# Altium schematic sheet CNEPuckCPURevG.SchDoc: Cable Node Expansion Puck
size C; Author: JDV; CompanyName: OPIsystems Inc; DrawnBy: JDV; Engineer: JDV; Organization: OPIsystems Inc; DocumentNumber: CNE; Revision: Rev G; SheetNumber: 1; SheetTotal: 3; PageSetup: Record=PageOptions|CenterHorizontal=True|CenterVertical=True|PrintScale=0.70|XCorrection=1.00|YCorrection=1.00|PrintKind=1|BorderSize=5000000|LeftOffset=0|BottomOffset=0|Orientation=2|PaperLength=4318|PaperWidth=2794|Scale=100|PaperSource=7|PrintQuality=600|MediaType=1|DitherType=10|PaperKind=11x17|PrintScaleMode=1; ProjectName: Swage
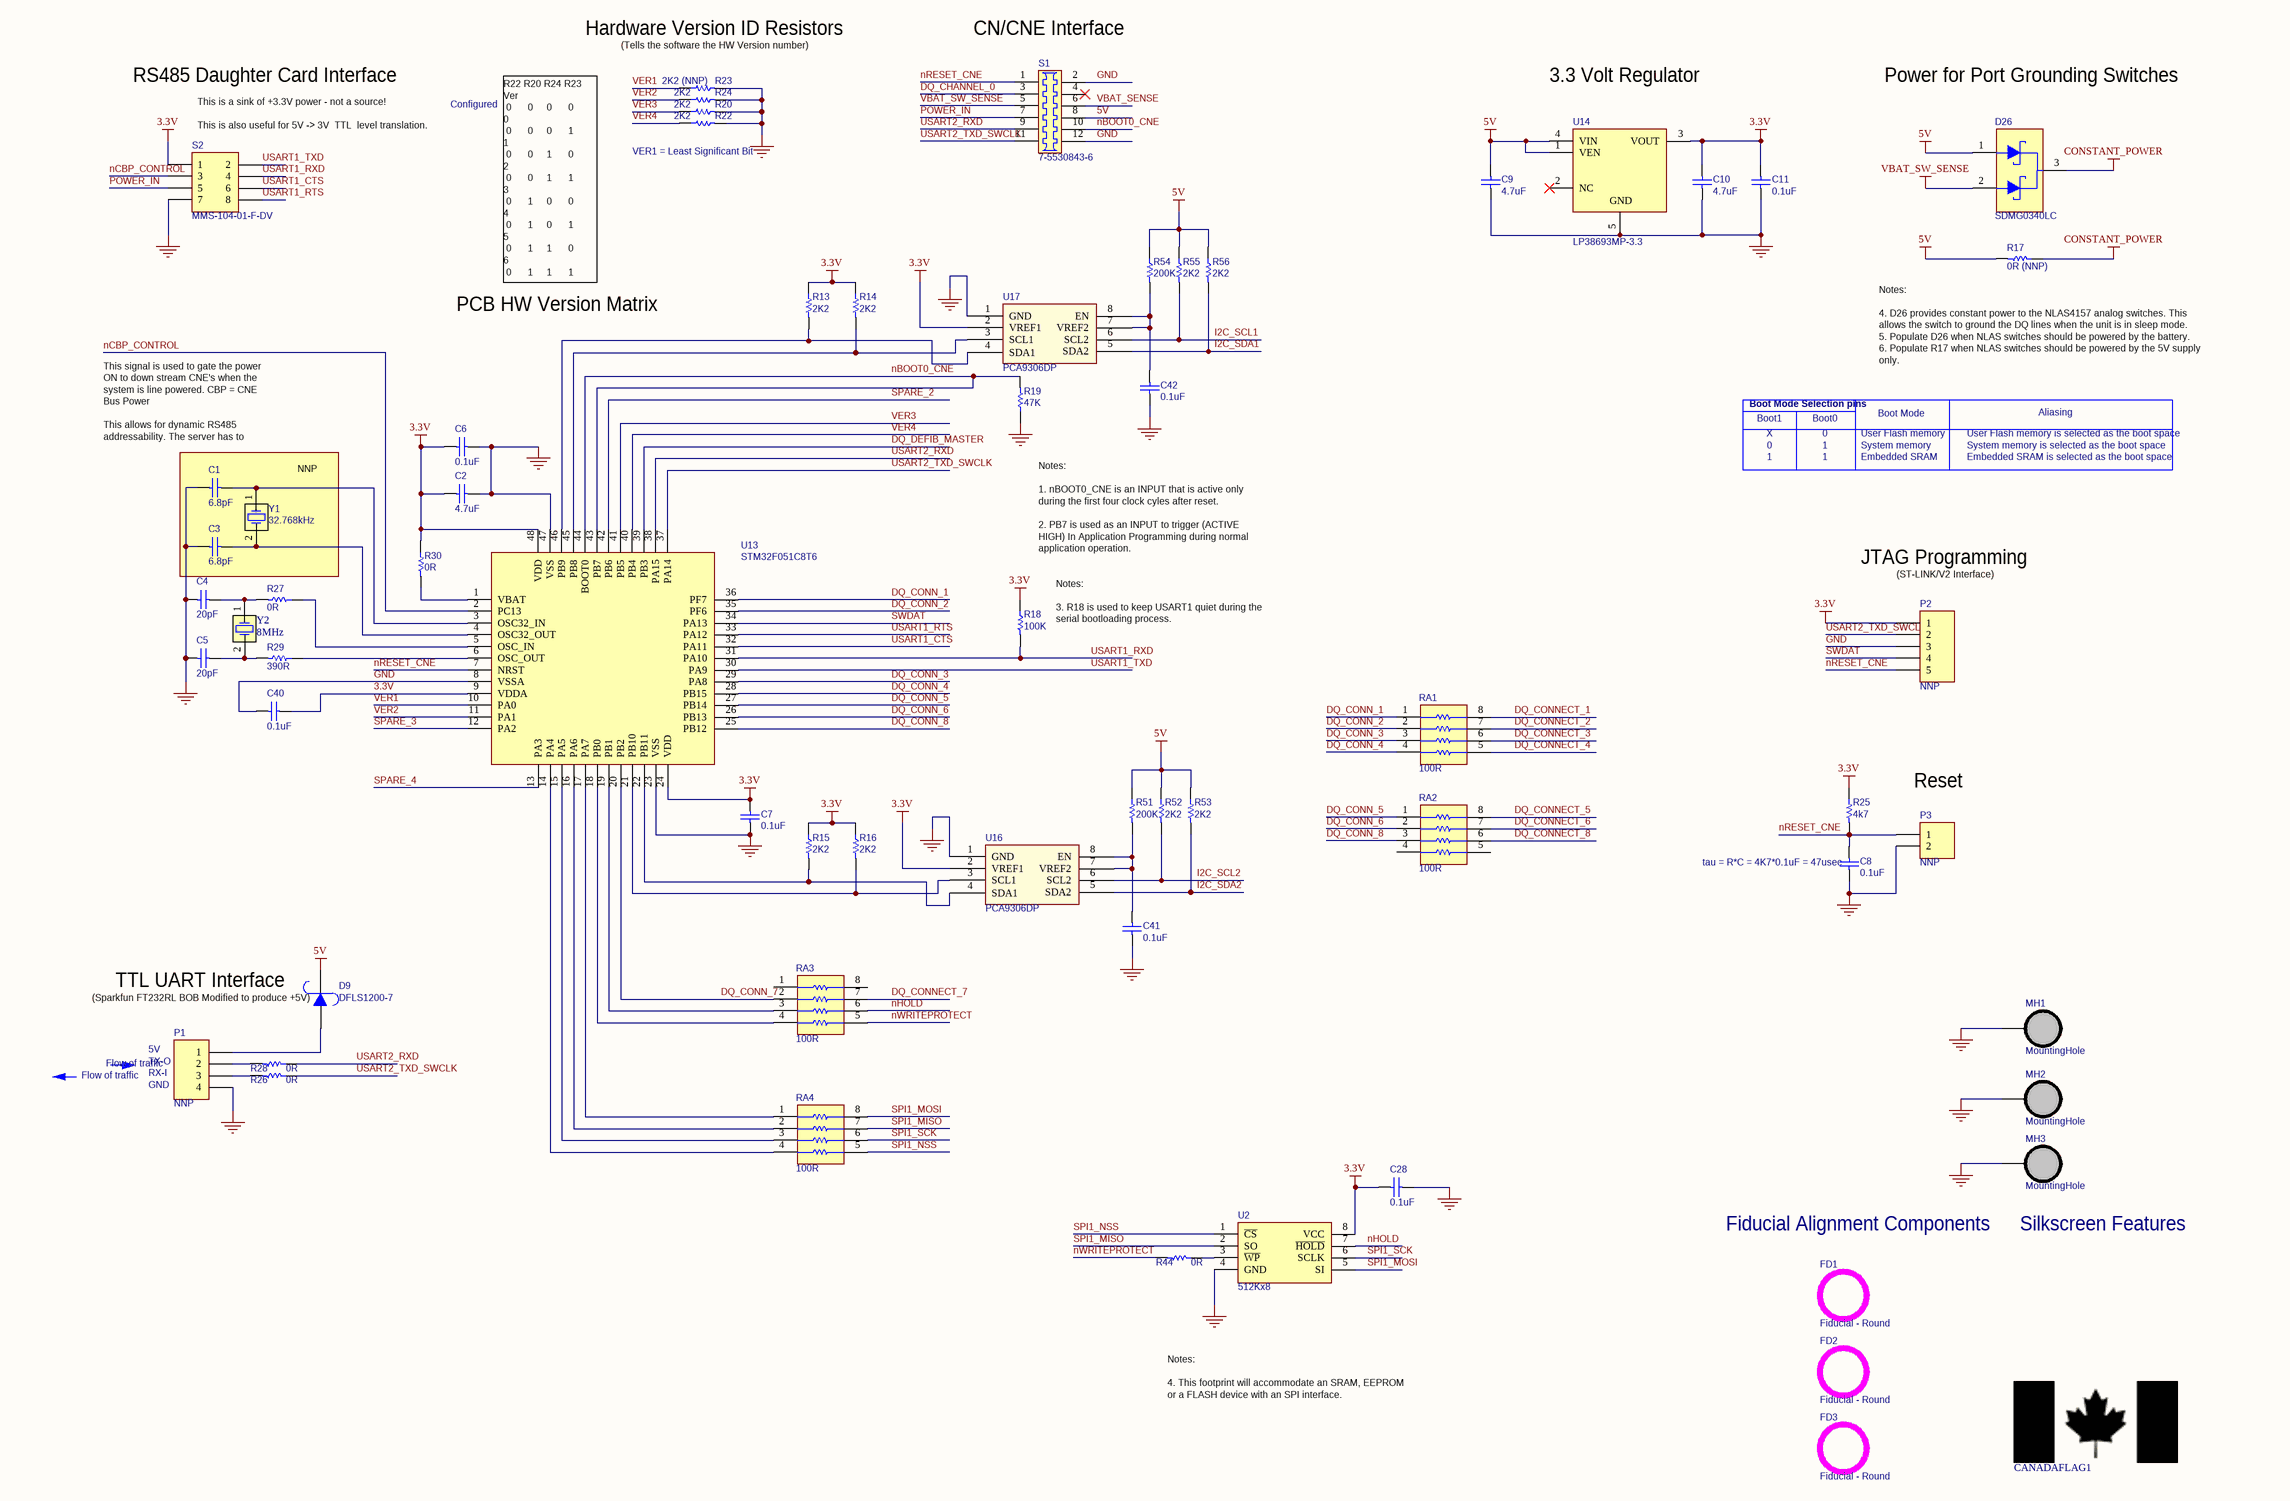
[diagram p0: CNEPuckCPURevG.SchDoc]

## Parts
C1  6.8pF  [RC0603]
C2  4.7uF  [RC0603]
C3  6.8pF  [RC0603]
C4  20pF  [RC0603]
C5  20pF  [RC0603]
C6  0.1uF  [RC0603]
C7  0.1uF  [RC0603]
C8  0.1uF  [RC0603]
C9  4.7uF  [RC0603]
C10  4.7uF  [RC0603]
C11  0.1uF  [RC0603]
C28  0.1uF  [RC0603]
C40  0.1uF  [RC0603]
C41  0.1uF  [RC0603]
C42  0.1uF  [RC0603]
CANADAFLAG1  Canada Flag  [CanadaFlag500x250]  (value not drawn)
D9  DFLS1200-7  [POWERDI-123]
D26  SDMG0340LC  [SOT-323]
FD1  Fiducial - Round  [FIDUCIAL ROUND SMALL]
FD2  Fiducial - Round  [FIDUCIAL ROUND SMALL]
FD3  Fiducial - Round  [FIDUCIAL ROUND SMALL]
MH1  MountingHole  [MountingHole]
MH2  MountingHole  [MountingHole]
MH3  MountingHole  [MountingHole]
P1  NNP  [HDR1X4]
P2  NNP  [HDR1X5]
P3  NNP  [HDR1X2]
R13  2K2  [RC0603]
R14  2K2  [RC0603]
R15  2K2  [RC0603]
R16  2K2  [RC0603]
R17  0R (NNP)  [RC0603]
R18  100K  [RC0603]
R19  47K  [RC0603]
R20  2K2  [RC0603]
R22  2K2  [RC0603]
R23  2K2 (NNP)  [RC0603]
R24  2K2  [RC0603]
R25  4k7  [RC0603]
R26  0R  [RC0603]
R27  0R  [RC0603]
R28  0R  [RC0603]
R29  390R  [RC0603]
R30  0R  [RC0603]
R44  0R  [RC0603]
R51  200K  [RC0603]
R52  2K2  [RC0603]
R53  2K2  [RC0603]
R54  200K  [RC0603]
R55  2K2  [RC0603]
R56  2K2  [RC0603]
RA1  100R  [exb28v]
RA2  100R  [exb28v]
RA3  100R  [exb28v]
RA4  100R  [exb28v]
S1  7-5530843-6  [EdgeConnector-6-12]
S2  MMS-104-01-F-DV  [hirose-2x4]
U2  512Kx8  [SOIC127P600X265-8N]
U13  STM32F051C8T6  [LQFP48-7x7mm]
U14  LP38693MP-3.3  [SOT223]
U16  PCA9306DP  [TSOP65P640X120-8N]
U17  PCA9306DP  [TSOP65P640X120-8N]
Y1  32.768kHz  [FX135]
Y2  8MHz  [NX8045GB]

## Blocks framed on the sheet
NNP: C1 C3 Y1

## Nets
3.3V: C2.2 C6.1 C7.1 C10.2 C11.2 C28.1 C40.2 P2.1 R13.1 R14.1 R15.1 R16.1 R18.1 R25.1 R30.2 S2.1 U2.8(VCC) U13.9(VDDA) U13.24(VDD) U13.48(VDD) U14.3(VOUT) U16.2(VREF1) U17.2(VREF1)
5V: C9.2 D9.2(K) D26.1(A) R17.1 R51.1 R52.1 R53.1 R54.1 R55.1 R56.1 S1.8(DESIGNATOR=8) U14.1(VEN) U14.4(VIN)
CONSTANT_POWER: D26.3(K) R17.2
GND: C1.2 C2.1 C3.2 C4.1 C5.1 C6.2 C7.2 C8.1 C9.1 C10.1 C11.1 C28.2 C40.1 C41.2 C42.2 MH1.1 MH2.1 MH3.1 P1.4 P2.3 P3.2 R19.1 R20.2 R22.2 R23.2 R24.2 S1.2(DESIGNATOR=2) S1.12(DESIGNATOR=12) S2.7 U2.4(GND) U13.8(VSSA) U13.23(VSS) U13.47(VSS) U14.5(GND) U16.1(GND) U17.1(GND)
VBAT_SW_SENSE: D26.2(A) S1.5(DESIGNATOR=5)
DQ_CHANNEL_0: S1.3(DESIGNATOR=3)
DQ_CONN_1: RA1.1 U13.36(PF7)
DQ_CONN_2: RA1.2 U13.35(PF6)
DQ_CONN_3: RA1.3 U13.29(PA8)
DQ_CONN_4: RA1.4 U13.28(PB15)
DQ_CONN_5: RA2.1 U13.27(PB14)
DQ_CONN_6: RA2.2 U13.26(PB13)
DQ_CONN_7: RA3.2 U13.20(PB2)
DQ_CONN_8: RA2.3 U13.25(PB12)
DQ_CONNECT_1: RA1.8
DQ_CONNECT_2: RA1.7
DQ_CONNECT_3: RA1.6
DQ_CONNECT_4: RA1.5
DQ_CONNECT_5: RA2.8
DQ_CONNECT_6: RA2.7
DQ_CONNECT_7: RA3.7
DQ_CONNECT_8: RA2.6
DQ_DEFIB_MASTER: U13.39(PB3)
I2C_SCL1: R55.2 U17.6(SCL2)
I2C_SCL2: R52.2 U16.6(SCL2)
I2C_SDA1: R56.2 U17.5(SDA2)
I2C_SDA2: R53.2 U16.5(SDA2)
nBOOT0_CNE: R19.2 S1.10(DESIGNATOR=10) U13.43(PB7) U13.44(BOOT0)
nCBP_CONTROL: S2.3 U13.2(PC13)
nHOLD: RA3.6 U2.7(~{HOLD})
nRESET_CNE: C8.2 P2.5 P3.1 R25.2 S1.1(DESIGNATOR=1) U13.7(NRST)
nWRITEPROTECT: R44.1 RA3.5
POWER_IN: S1.7(DESIGNATOR=7) S2.5
SPARE_2: U13.42(PB6)
SPARE_3: U13.12(PA2)
SPARE_4: U13.13(PA3)
SPI1_MISO: RA4.7 U2.2(SO)
SPI1_MOSI: RA4.8 U2.5(SI)
SPI1_NSS: RA4.5 U2.1(~{CS})
SPI1_SCK: RA4.6 U2.6(SCLK)
SWDAT: P2.4 U13.34(PA13)
USART1_CTS: S2.6 U13.32(PA11)
USART1_RTS: S2.8 U13.33(PA12)
USART1_RXD: R18.2 S2.4 U13.31(PA10)
USART1_TXD: S2.2 U13.30(PA9)
USART2_RXD: R28.2 S1.9(DESIGNATOR=9) U13.38(PA15)
USART2_TXD_SWCLK: P2.2 R26.2 S1.11(DESIGNATOR=11) U13.37(PA14)
VBAT_SENSE: S1.6(DESIGNATOR=6)
VER1: R23.1 U13.10(PA0)
VER2: R24.1 U13.11(PA1)
VER3: R20.1 U13.41(PB5)
VER4: R22.1 U13.40(PB4)
NetC1_1: C1.1 U13.3(OSC32_IN) Y1.1(OSC1)
NetC3_1: C3.1 U13.4(OSC32_OUT) Y1.2(OSC2)
NetC4_2: C4.2 R27.1 Y2.1(OSC1)
NetC5_2: C5.2 R29.2 Y2.2(OSC2)
NetC41_1: C41.1 R51.2 U16.7(VREF2) U16.8(EN)
NetC42_1: C42.1 R54.2 U17.7(VREF2) U17.8(EN)
NetD9_1: D9.1(A) P1.1
NetP1_2: P1.2 R28.1
NetP1_3: P1.3 R26.1
NetR13_2: R13.2 U13.46(PB9) U17.4(SDA1)
NetR14_2: R14.2 U13.45(PB8) U17.3(SCL1)
NetR15_2: R15.2 U13.22(PB11) U16.4(SDA1)
NetR16_2: R16.2 U13.21(PB10) U16.3(SCL1)
NetR27_2: R27.2 U13.5(OSC_IN)
NetR29_1: R29.1 U13.6(OSC_OUT)
NetR30_1: R30.1 U13.1(VBAT)
NetR44_2: R44.2 U2.3(~{WP})
NetRA3_3: RA3.3 U13.19(PB1)
NetRA3_4: RA3.4 U13.18(PB0)
NetRA4_1: RA4.1 U13.17(PA7)
NetRA4_2: RA4.2 U13.16(PA6)
NetRA4_3: RA4.3 U13.15(PA5)
NetRA4_4: RA4.4 U13.14(PA4)

Not connected (* = marked no-connect by the designer): RA2 4 5; RA3 1 8; S1 4(DESIGNATOR=4)*; U14 2(NC)*

## Notes on the sheet
- Hardware Version ID Resistors
- (Tells the software the HW Version number)
- (near S1) CN/CNE Interface
- RS485 Daughter Card Interface
- (near S2) This is a sink of +3.3V power - not a source!
  This is also useful for 5V -> 3V  TTL  level translation.
- Configured
- 3.3 Volt Regulator
- Power for Port Grounding Switches
- VER1 = Least Significant Bit
- PCB HW Version Matrix
- R22 R20 R24 R23  Ver
  0      0     0      0       0
  0      0     0      1       1
  0      0     1      0       2
  0      0     1      1       3
  0      1     0      0       4
  0      1     0      1       5
  0      1     1      0       6
  0      1     1      1       7
  1      0     0      0       8
  1      0     0      1       9
  1      0     1      0       10
  1      0     1      1       11
  1      1     0      0       12
  1      1     0      1       13
  1      1     1      0       14
  1      1     1      1       15
- (near R17) Notes:
  4. D26 provides constant power to the NLAS4157 analog switches. This allows the switch to ground the DQ lines when the unit is in sleep mode.
  5. Populate D26 when NLAS switches should be powered by the battery.
  6. Populate R17 when NLAS switches should be powered by the 5V supply only.
- Boot Mode Selection pins
- Boot1
- Boot0
- Boot Mode
- Aliasing
- This signal is used to gate the power ON to down stream CNE's when the system is line powered. CBP = CNE Bus Power
  This allows for dynamic RS485 addressability. The server has to discover and assign an address to this unit.
- X
- 1
- 0
- User Flash memory
- System memory
- Embedded SRAM
- User Flash memory is selected as the boot space
- System memory is selected as the boot space
- Embedded SRAM is selected as the boot space
- Notes:
  1. nBOOT0_CNE is an INPUT that is active only during the first four clock cyles after reset.
  2. PB7 is used as an INPUT to trigger (ACTIVE HIGH) In Application Programming during normal application operation.
- JTAG Programming
- (near P2) (ST-LINK/V2 Interface)
- (near R18) Notes:
  3. R18 is used to keep USART1 quiet during the serial bootloading process.
- Reset
- (near C8) tau = R*C = 4K7*0.1uF = 47usec
- (near D9) (Sparkfun FT232RL BOB Modified to produce +5V)
- (near D9) TTL UART Interface
- Flow of traffic
- 5V
- (near P1) TX-O
- (near P1) RX-I
- (near P1) GND
- Fiducial Alignment Components
- Silkscreen Features
- Notes:
  4. This footprint will accommodate an SRAM, EEPROM or a FLASH device with an SPI interface.
- Title:
- OPIsystems Inc.
- Size:
- Date:
- File:
- C
- Number:
- Time:
- Revision:
- Sheet
- of
- Calgary, AB, Canada
- T2E 6M8
- 403-219-3177
- www.opisystems.com
- 1216 - 36th Avenue NE

## Library data of the parts
C1 C3 = C1608C0G1H6R8D: CAP CER 6.8PF 50V NP0 0603; Manufacturer: TDK Corporation; Tolerance: ±0.5pF; Temperature Coefficient: C0G, NP0; OPI_VID: 101353; Supplier 1: Digi-Key; Manufacturer Part Number: C1608C0G1H6R8D; RoHS: RoHS Compliant; Category: Capacitors; Stock 1: 72000; Pricing 1: 4000=0.00863, 8000=0.00788, 12000=0.00751, 28000=0.00713, 100000=0.00516 (CAD); Capacitance: 6.8pF; Voltage - Rated: 50V; Mounting Type: Surface Mount, MLCC; Operating Temperature: -55°C ~ 125°C; Applications: General Purpose; Ratings: -; Package / Case: 0603 (1608 Metric); Size / Dimension: 0.063" L x 0.031" W (1.60mm x 0.80mm); Height - Seated (Max): -; Thickness (Max): 0.037" (0.95mm); Lead Spacing: -; Features: -; Packaging: Tape & Reel (TR); Lead Style: -; ComponentLink1URL: http://www.tdk.com/pdf/general_B11.pdf; ComponentLink1Description: http://www.tdk.com/pdf/general_B11.pdf; Supplier Part Number 1: 445-5039-2-ND
C2 C9 C10 = C1608X5R1A475K/0.50: CAP CER 4.7UF 10V 10% X5R 0603; Manufacturer: TDK Corporation; Capacitance: 4.7µF; OPI_VID: 101354; Supplier 1: Digi-Key; Manufacturer Part Number: C1608X5R1A475K/0.50; RoHS: RoHS Compliant; Category: Capacitors; Stock 1: 44000; Pricing 1: 4000=0.04904, 8000=0.04639, 12000=0.044, 28000=0.04241, 100000=0.03512 (CAD); Voltage - Rated: 10V; Tolerance: ±10%; Temperature Coefficient: X5R; Mounting Type: Surface Mount, MLCC; Operating Temperature: -55°C ~ 85°C; Applications: General Purpose; Ratings: -; Package / Case: 0603 (1608 Metric); Size / Dimension: 0.063" L x 0.031" W (1.60mm x 0.80mm); Height - Seated (Max): -; Thickness (Max): 0.022" (0.55mm); Lead Spacing: -; Features: -; Packaging: Tape & Reel (TR); Lead Style: -; ComponentLink1URL: http://www.tdk.com/pdf/general_B11.pdf; ComponentLink1Description: http://www.tdk.com/pdf/general_B11.pdf; Supplier Part Number 1: 445-7482-2-ND
C4 C5 = CC0603JRNPO9BN200: CAP CER 20PF 50V 5% NPO 0603; Manufacturer: Yageo; Temperature Coefficient: C0G, NP0; OPI_VID: 101355; Supplier 1: Digi-Key; Manufacturer Part Number: CC0603JRNPO9BN200; RoHS: RoHS Compliant; Category: Capacitors; Stock 1: 4000; Pricing 1: 4000=0.00619, 8000=0.00565, 12000=0.00538, 28000=0.00511, 100000=0.0037 (CAD); Capacitance: 20pF; Voltage - Rated: 50V; Tolerance: ±5%; Mounting Type: Surface Mount, MLCC; Operating Temperature: -55°C ~ 125°C; Applications: General Purpose; Ratings: -; Package / Case: 0603 (1608 Metric); Size / Dimension: 0.063" L x 0.031" W (1.60mm x 0.80mm); Height - Seated (Max): -; Thickness (Max): 0.035" (0.90mm); Lead Spacing: -; Features: -; Packaging: Tape & Reel (TR); Lead Style: -; ComponentLink1URL: http://www.yageo.com/documents/recent/UPY-GP_NP0_16V-to-50V_8.pdf; ComponentLink1Description: http://www.yageo.com/documents/recent/UPY-GP_NP0_16V-to-50V_8.pdf; Supplier Part Number 1: 311-1424-2-ND
C6-C8 C11 C28 C40-C42 = 0603YC104KAT2A: CAP CERM .1UF 10% 16V X7R 0603; Manufacturer: AVX Corporation; Category 1: Capacitors; Capacitance: 0.1µF; OPI_VID: 100039; Supplier 1: Digi-Key; Supplier Part Number 1: 478-1239-2-ND; RoHS 1: RoHS Compliant; Description 1: CAP CERM .1UF 10% 16V X7R 0603; Stock 1: 5240000; Pricing 1: 4000=0.003, 12000=0.002, 24000=0.002 (USD); Voltage - Rated: 16V; Tolerance: ±10%; Temperature Coefficient: X7R; Mounting Type: Surface Mount, MLCC; Operating Temperature: -55°C ~ 125°C; Features: -; Applications: General Purpose; Ratings: -; Package / Case: 0603 (1608 Metric); Size / Dimension: 0.063" L x 0.031" W (1.60mm x 0.80mm); Thickness: 0.90mm Max; Lead Spacing: -; Packaging: Tape & Reel (TR); Lead Style: -; ComponentLink1URL: http://www.avx.com/docs/Catalogs/cx7r.pdf; ComponentLink1Description: http://www.avx.com/docs/Catalogs/cx7r.pdf; Manufacturer Part Number: 0603YC104KAT2A
CANADAFLAG1 = CanadaFlag
D9 = DFLS1200-7: DIODE SCHOTTKY 1A 200V PWRDI 123; Manufacturer: Diodes Inc; Voltage - Forward (Vf) (Max) @ If: 850mV @ 1A; Speed: Fast Recovery =< 500ns, > 200mA (Io); Current - Reverse Leakage @ Vr: 2µA @ 200V; Capacitance @ Vr, F: 23pF @ 5V, 1MHz; OPI_VID: 101018; Supplier 1: Digi-Key; Supplier Part Number 1: DFLS1200DITR-ND; Manufacturer Part Number: DFLS1200-7; RoHS: RoHS Compliant; Category: Discrete Semiconductor Products; Stock 1: 21000; Pricing 1: 3000=0.22411, 6000=0.21017, 12000=0.19516, 27000=0.18444, 51000=0.18122 (CAD); Diode Type: Schottky; Voltage - DC Reverse (Vr) (Max): 200V; Current - Average Rectified (Io): 1A; Reverse Recovery Time (trr): -; Mounting Type: Surface Mount; Package / Case: 2-SMD, Flat Lead; Supplier Device Package: PowerDI™ 123; Packaging: Tape & Reel (TR); ComponentLink1URL: http://www.diodes.com/datasheets/ds30628.pdf; ComponentLink1Description: http://www.diodes.com/datasheets/ds30628.pdf
D26 = SDMG0340LC-7-F: DIODE SCHOTTKY 40V 30MA SOT323; Manufacturer: Diodes Inc; Voltage - Forward (Vf) (Max) @ If: 370mV @ 1mA; Current - Reverse Leakage @ Vr: 1µA @ 10V; Current - Average Rectified (Io) (per Diode): 30mA (DC); Speed: Small Signal =< 200mA (Io), Any Speed; Diode Configuration: 1 Pair Common Cathode; OPI_VID: 101482; Supplier 1: Digi-Key; Supplier Part Number 1: SDMG0340LC-FDITR-ND; Manufacturer Part Number: SDMG0340LC-7-F; RoHS: RoHS Compliant; Category: Discrete Semiconductor Products; Stock 1: 18000; Pricing 1: 3000=0.08059, 6000=0.07254, 15000=0.06447, 30000=0.06045, 75000=0.05359, 150000=0.05037 (CAD); Packaging: Tape & Reel (TR); Voltage - DC Reverse (Vr) (Max): 40V; Reverse Recovery Time (trr): -; Diode Type: Schottky; Mounting Type: Surface Mount; Package / Case: SC-70, SOT-323; Supplier Device Package: SOT-323; ComponentLink1URL: http://www.diodes.com/datasheets/ds30248.pdf; ComponentLink1Description: http://www.diodes.com/datasheets/ds30248.pdf
FD1-FD3 = Fiducial: Fiducial Round
MH1-MH3 = MountingHole: PCB Mounting Hole, 0.150" hole, 0.270" Keepout
P1 = Header 4: Header, 4-Pin; Manufacturer: 3M; Manufacturer Part Number: 2340-6111TG; OPI_VID: 100210; Comment_1: Cut to 4 Position; LatestRevisionDate: 17-Jul-2002; LatestRevisionNote: Re-released for DXP Platform.; Publisher: Altium Limited
P2 = Header 5: Header, 5-Pin; Manufacturer Part Number: 2340-6111TG; Manufacturer: 3M; OPI_VID: 100210; Comment_1: Cut to 5 Position; LatestRevisionDate: 17-Jul-2002; LatestRevisionNote: Re-released for DXP Platform.; Publisher: Altium Limited
P3 = Header 2: Header, 2-Pin; Manufacturer: 3M; Manufacturer Part Number: 2340-6111TG; OPI_VID: 100210; LatestRevisionDate: 17-Jul-2002; LatestRevisionNote: Re-released for DXP Platform.; Publisher: Altium Limited
R13-R16 R20 R22-R24 R52 R53 R55 R56 = ERJ-3GEYJ222V: RES 2.2K OHM 1/10W 5% 0603 SMD; Manufacturer: Panasonic Electronic Components; Power (Watts): 0.1W, 1/10W; Temperature Coefficient: ±200ppm/°C; OPI_VID: 101388; Supplier 1: Digi-Key; Supplier Part Number 1: P2.2KGTR-ND; Manufacturer Part Number: ERJ-3GEYJ222V; RoHS: RoHS Compliant; Category: Resistors; Stock 1: 970000; Pricing 1: 5000=0.00176, 10000=0.00153, 25000=0.00134, 50000=0.00123, 125000=0.00121 (CAD); Resistance (Ohms): 2.2k; Composition: Thick Film; Features: -; Tolerance: ±5%; Package / Case: 0603 (1608 Metric); Size / Dimension: 0.063" L x 0.031" W (1.60mm x 0.80mm); Height: 0.022" (0.55mm); Number of Terminations: 2; Packaging: Tape & Reel (TR); ComponentLink1URL: http://industrial.panasonic.com/www-cgi/jvcr13pz.cgi?E+PZ+3+AOA0001+ERJ3GEYJ222V+7+WW; ComponentLink1Description: http://industrial.panasonic.com/www-cgi/jvcr13pz.cgi?E+PZ+3+AOA0001+ERJ3GEYJ222V+7+WW; Supplier Device Package: 0603
R17 R26-R28 R30 R44 = ERJ-3GEY0R00V: RES 0.0 OHM 1/10W 0603 SMD; Manufacturer: Panasonic - ECG; Category 1: Resistors; Resistance (Ohms): 0.0; Power (Watts): 0.1W, 1/10W; Temperature Coefficient: -100/ +600ppm/°C; Tolerance: Jumper; OPI_VID: 101042; Supplier 1: Digi-Key; Supplier Part Number 1: P0.0GTR-ND; RoHS 1: RoHS Compliant; Description 1: RES 0.0 OHM 1/10W 0603 SMD; Stock 1: 25505000; Pricing 1: 5000=0.00171, 10000=0.00149, 25000=0.00131 (USD); Composition: Thick Film; Features: -; Size / Dimension: 0.063" L x 0.031" W (1.60mm x 0.80mm); Height: 0.018" (0.45mm); Lead Style: Surface Mount (SMD - SMT); Packaging: Tape & Reel (TR); Package / Case: 0603 (1608 Metric); ComponentLink1URL: http://industrial.panasonic.com/www-cgi/jvcr13pz.cgi?E+PZ+3+AOA0001+ERJ3GEY0R00V+7+WW; ComponentLink1Description: http://industrial.panasonic.com/www-cgi/jvcr13pz.cgi?E+PZ+3+AOA0001+ERJ3GEY0R00V+7+WW; Manufacturer Part Number: ERJ-3GEY0R00V
R18 = ERJ-3GEYJ104V: RES 100K OHM 1/10W 5% 0603 SMD; Manufacturer: Panasonic Electronic Components; Power (Watts): 0.1W, 1/10W; Temperature Coefficient: ±200ppm/°C; OPI_VID: 101335; Supplier 1: Digi-Key; Manufacturer Part Number: ERJ-3GEYJ104V; RoHS: RoHS Compliant; Category: Resistors; Stock 1: 3755000; Pricing 1: 5000=0.00172, 10000=0.00149, 25000=0.00131, 50000=0.0012, 125000=0.00118 (CAD); Resistance (Ohms): 100k; Composition: Thick Film; Features: -; Tolerance: ±5%; Package / Case: 0603 (1608 Metric); Size / Dimension: 0.063" L x 0.031" W (1.60mm x 0.80mm); Height: 0.022" (0.55mm); Number of Terminations: 2; Packaging: Tape & Reel (TR); ComponentLink1URL: http://industrial.panasonic.com/www-cgi/jvcr13pz.cgi?E+PZ+3+AOA0001+ERJ3GEYJ104V+7+WW; ComponentLink1Description: http://industrial.panasonic.com/www-cgi/jvcr13pz.cgi?E+PZ+3+AOA0001+ERJ3GEYJ104V+7+WW; Supplier Part Number 1: P100KGTR-ND
R19 = ERJ-3GEYJ473V: RES 47K OHM 1/10W 5% 0603 SMD; Manufacturer: Panasonic - ECG; Category 1: Resistors; Power (Watts): 0.1W, 1/10W; Temperature Coefficient: ±200ppm/°C; OPI_VID: 101043; Supplier 1: Digi-Key; Supplier Part Number 1: P47KGTR-ND; RoHS 1: RoHS Compliant; Description 1: RES 47K OHM 1/10W 5% 0603 SMD; Stock 1: 2125000; Pricing 1: 5000=0.00171, 10000=0.00149, 25000=0.00131 (USD); Resistance (Ohms): 47K; Composition: Thick Film; Features: -; Tolerance: ±5%; Size / Dimension: 0.063" L x 0.031" W (1.60mm x 0.80mm); Height: 0.018" (0.45mm); Lead Style: Surface Mount (SMD - SMT); Packaging: Tape & Reel (TR); Package / Case: 0603 (1608 Metric); ComponentLink1URL: http://industrial.panasonic.com/www-cgi/jvcr13pz.cgi?E+PZ+3+AOA0001+ERJ3GEYJ473V+7+WW; ComponentLink1Description: http://industrial.panasonic.com/www-cgi/jvcr13pz.cgi?E+PZ+3+AOA0001+ERJ3GEYJ473V+7+WW; Manufacturer Part Number: ERJ-3GEYJ473V
R25 = ERJ-3GEYJ472V: RES 4.7K OHM 1/10W 5% 0603 SMD; Manufacturer: Panasonic - ECG; Power (Watts): 0.1W, 1/10W; Temperature Coefficient: ±200ppm/°C; OPI_VID: 101175; Supplier 1: Digi-Key; Supplier Part Number 1: P4.7KGTR-ND; Manufacturer Part Number: ERJ-3GEYJ472V; RoHS: RoHS Compliant; Category: Resistors; Stock 1: 6230000; Pricing 1: 5000=0.00174, 10000=0.00151, 25000=0.00132 (CAD); Resistance (Ohms): 4.7K; Composition: Thick Film; Features: -; Tolerance: ±5%; Size / Dimension: 0.063" L x 0.031" W (1.60mm x 0.80mm); Height: 0.022" (0.55mm); Number of Terminations: 2; Packaging: Tape & Reel (TR); Package / Case: 0603 (1608 Metric); ComponentLink1URL: http://industrial.panasonic.com/www-cgi/jvcr13pz.cgi?E+PZ+3+AOA0001+ERJ3GEYJ472V+7+WW; ComponentLink1Description: http://industrial.panasonic.com/www-cgi/jvcr13pz.cgi?E+PZ+3+AOA0001+ERJ3GEYJ472V+7+WW
R29 = ERJ-3GEYJ391V: RES 390 OHM 1/10W 5% 0603 SMD; Manufacturer: Panasonic Electronic Components; Resistance (Ohms): 390; Power (Watts): 0.1W, 1/10W; Temperature Coefficient: ±200ppm/°C; OPI_VID: 101357; Supplier 1: Digi-Key; Manufacturer Part Number: ERJ-3GEYJ391V; RoHS: RoHS Compliant; Category: Resistors; Stock 1: 1115000; Pricing 1: 5000=0.00174, 10000=0.00151, 25000=0.00132, 50000=0.00122, 125000=0.00119 (CAD); Composition: Thick Film; Features: -; Tolerance: ±5%; Package / Case: 0603 (1608 Metric); Size / Dimension: 0.063" L x 0.031" W (1.60mm x 0.80mm); Height: 0.022" (0.55mm); Number of Terminations: 2; Packaging: Tape & Reel (TR); ComponentLink1URL: http://industrial.panasonic.com/www-cgi/jvcr13pz.cgi?E+PZ+3+AOA0001+ERJ3GEYJ391V+7+WW; ComponentLink1Description: http://industrial.panasonic.com/www-cgi/jvcr13pz.cgi?E+PZ+3+AOA0001+ERJ3GEYJ391V+7+WW; Supplier Part Number 1: P390GTR-ND
R51 R54 = ERJ-3GEYJ204V: RES 200K OHM 1/10W 5% 0603 SMD; Manufacturer: Panasonic Electronic Components; Resistance (Ohms): 100k; Power (Watts): 0.1W, 1/10W; Temperature Coefficient: ±200ppm/°C; OPI_VID: 101538; Supplier 1: Digi-Key; Supplier Part Number 1: P100KGTR-ND; Manufacturer Part Number: ERJ-3GEYJ204V; RoHS: RoHS Compliant; Category: Resistors; Stock 1: 3755000; Pricing 1: 5000=0.00172, 10000=0.00149, 25000=0.00131, 50000=0.0012, 125000=0.00118 (CAD); Composition: Thick Film; Features: -; Tolerance: ±5%; Package / Case: 0603 (1608 Metric); Size / Dimension: 0.063" L x 0.031" W (1.60mm x 0.80mm); Height: 0.022" (0.55mm); Number of Terminations: 2; Packaging: Tape & Reel (TR); ComponentLink1URL: http://industrial.panasonic.com/www-cgi/jvcr13pz.cgi?E+PZ+3+AOA0001+ERJ3GEYJ104V+7+WW; ComponentLink1Description: http://industrial.panasonic.com/www-cgi/jvcr13pz.cgi?E+PZ+3+AOA0001+ERJ3GEYJ104V+7+WW
RA1-RA4 = EXB-28V101JX: RES ARRAY 100 OHM 4 RES 0804; Manufacturer: Panasonic Electronic Components; Circuit Type: Isolated; Resistance (Ohms): 100; Number of Resistors: 4; Power Per Element: 31mW; Tolerance: ±5%; Temperature Coefficient: ±200ppm/°C; OPI_VID: 101389; Supplier 1: Digi-Key; Supplier Part Number 1: Y7101TR-ND; Manufacturer Part Number: EXB-28V101JX; RoHS: RoHS Compliant; Category: Resistors; Stock 1: 200000; Pricing 1: 10000=0.01298, 30000=0.01141, 50000=0.01047, 100000=0.01025 (CAD); Number of Pins: 8; Applications: -; Mounting Type: Surface Mount; Package / Case: 0804 (2010 Metric), Convex; Supplier Device Package: 0402 x 4; Size / Dimension: 0.079" L x 0.039" W (2.00mm x 1.00mm); Height: 0.014" (0.35mm); Packaging: Tape & Reel (TR); Operating Temperature: -55°C ~ 125°C; ComponentLink1URL: http://industrial.panasonic.com/www-cgi/jvcr13pz.cgi?E+PZ+3+AOC0001+EXB28V101JX+7+WW; ComponentLink1Description: http://industrial.panasonic.com/www-cgi/jvcr13pz.cgi?E+PZ+3+AOC0001+EXB28V101JX+7+WW
S1 = 7-5530843-6: CONN EDGECARD 6POS .100 VERT; Manufacturer: TE Connectivity; Card Type: Multibus I; Gender: Female; Number of Positions: 12; Card Thickness: 0.054" ~ 0.070" (1.37mm ~ 1.78mm); Pitch: 0.100" (2.54mm); Material - Insulation: Polyester, Glass Filled; Read Out: Dual; OPI_VID: 101359; Supplier 1: Digi-Key; Manufacturer Part Number: 7-5530843-6; RoHS: RoHS Compliant; Category: Connectors, Interconnects; Stock 1: 2145; Pricing 1: 1=2.55, 10=2.316, 25=2.1748, 50=2.08, 100=1.9855, 250=1.79636, 500=1.65458, 1000=1.41821, 2500=1.32366 (CAD); Number of Positions/Bay/Row: -; Number of Rows: 2; Features: -; Mounting Type: Through Hole; Termination: Solder; Contact Material: Phosphor Bronze; Contact Finish: Gold; Contact Finish Thickness: 30µin (0.76µm); Contact Type: -; Color: Black; Packaging: Bulk; Flange Feature: -; Operating Temperature: -55°C ~ 85°C; ComponentLink1URL: http://www.te.com/commerce/DocumentDelivery/DDEController?Action=srchrtrv&DocNm=5530843&DocType=Customer+Drawing&DocLang=English; ComponentLink1Description: http://www.te.com/commerce/DocumentDelivery/DDEController?Action=srchrtrv&DocNm=5530843&DocType=Customer+Drawing&DocLang=English; Supplier Part Number 1: 7-5530843-6-ND
S2 = MMS-104-01-F-DV: CONN RCPT 2MM 8POS DL VERT PCB; Manufacturer: Samtec Inc; Connector Type: Receptacle; Number of Positions: 8; Number of Positions Loaded: All; Pitch: 0.079" (2.00mm); OPI_VID: 101488; Single Source: YES, 2 week lead time; Supplier 1: Digi-Key; Manufacturer Part Number: MMS-104-01-F-DV; RoHS: RoHS Compliant; Category: Connectors, Interconnects; Stock 1: 0; Pricing 1: 1=2.61, 10=2.261, 100=1.9131, 500=1.52184, 1000=1.23922, 5000=1.13051, 10000=1.08703 (CAD); Contact Type: Female Socket; Number of Rows: 2; Row Spacing: 0.079" (2.00mm); Mounting Type: Through Hole; Termination: Solder; Fastening Type: -; Features: -; Contact Finish: Tin; Contact Finish Thickness: -; Color: Black; Packaging: Tube; ComponentLink1URL: http://www.samtec.com/ftppub/cpdf/MMS01MKT.PDF; ComponentLink1Description: http://www.samtec.com/ftppub/cpdf/MMS01MKT.PDF; Supplier Part Number 1: SAM1232-04-ND
U2 = 23LCV512-I/SN: IC SRAM SPI 512K 2.5V 8SOIC; Manufacturer: Microchip Technology; Format - Memory: RAM; Memory Type: NVSRAM (Non-Volatile SRAM); Memory Size: 512K (64K x 8); Speed: 20MHz; Interface: SPI Serial; Voltage - Supply: 2.5 V ~ 5.5 V; OPI_VID: 101391; Single Source: YES, 13 week lead time; Supplier 1: Digi-Key; Manufacturer Part Number: 23LCV512-I/SN; RoHS: RoHS Compliant; Category: Integrated Circuits (ICs); Stock 1: 300; Pricing 1: 1=2.59, 10=1.847, 25=1.782, 100=1.7061 (CAD); Operating Temperature: -40°C ~ 85°C; Package / Case: 8-SOIC (0.154", 3.90mm Width); Supplier Device Package: 8-SOIC N; Packaging: Tube; Supplier Part Number 1: 23LCV512-I/SN-ND
U13 = STM32F051C8T6: IC MCU 32BIT 64KB FLASH 48LQFP; Manufacturer: STMicroelectronics; Core Processor: ARM® Cortex™-M0; Core Size: 32-Bit; Speed: 48MHz; Connectivity: HDMI-CEC, I²C, IrDA, LIN, SPI, UART/USART; Peripherals: DMA, I²S, POR, PWM, WDT; Number of I /O: 39; Program Memory Size: 64KB (64K x 8); RAM Size: 8K x 8; Voltage - Supply (Vcc/Vdd): 2 V ~ 3.6 V; Data Converters: A/D 10x12b, D/A 1x12b; Oscillator Type: Internal; OPI_VID: 101360; Supplier 1: Digi-Key; Manufacturer Part Number: STM32F051C8T6; RoHS: RoHS Compliant; Category: Integrated Circuits (ICs); Stock 1: 197; Pricing 1: 1=3.74, 10=3.346, 25=3.0112, 100=2.7434, 250=2.47576, 500=2.22148, 1000=1.87354, 2500=1.77986, 5000=1.71295 (CAD); Program Memory Type: FLASH; EEPROM Size: -; Operating Temperature: -40°C ~ 85°C; Package / Case: 48-LQFP; Packaging: Tray; ComponentLink1URL: http://www.st.com/internet/com/TECHNICAL_RESOURCES/TECHNICAL_LITERATURE/DATA_BRIEF/DM00026694.pdf; ComponentLink1Description: http://www.st.com/internet/com/TECHNICAL_RESOURCES/TECHNICAL_LITERATURE/DATA_BRIEF/DM00026694.pdf; Supplier Part Number 1: 497-12893-ND
U14 = LP38693MP-3.3/NOPB: IC REG LDO 500MA 3.3V SOT223-4; Manufacturer: National Semiconductor; Regulator Topology: Positive Fixed; Voltage - Input: Up to 10V; Voltage - Dropout (Typical): 0.33V @ 500mA; Number of Regulators: 1; OPI_VID: 101178; Supplier 1: Digi-Key; Supplier Part Number 1: LP38693MP-3.3TR-ND; Manufacturer Part Number: LP38693MP-3.3/NOPB; RoHS: RoHS Compliant; Category: Integrated Circuits (ICs); Stock 1: 2000; Pricing 1: 1000=0.79351, 3000=0.73882, 5000=0.71094, 10000=0.68413 (CAD); Voltage - Output: 3.3V; Current - Output: 500mA; Current - Limit (Min): -; Operating Temperature: -40°C ~ 125°C; Mounting Type: Surface Mount; Package / Case: TO-261-5, TO-261AB; Supplier Device Package: SOT-223-5; Packaging: Tape & Reel (TR); ComponentLink1URL: http://www.ti.com/lit/ds/symlink/lp38691.pdf; ComponentLink1Description: http://www.ti.com/lit/ds/symlink/lp38691.pdf
U16 U17 = PCA9306DP: IC LEVEL TRANSLATOR - TSSOP8; Manufacturer: ON Semiconductor; Manufacturer Part Number: PCA9306DTR2G; OPI_VID: 101536; Description 1: IC VOLT LEVEL TRANSLATOR 8-TSSOP; Category 1: Integrated Circuits (ICs); Logic Function: Translator, Bidirectional, Open Drain; Number of Bits: 2; Input Type: Voltage; Number of Outputs/Channel: 1; Differential - Input:Output: No/No; Propagation Delay (Max): 0.6ns; Voltage - Supply: 1 V ~ 3.6 V, 1.8 V ~ 5.5 V; Supplier 1: Digi-Key; Supplier Part Number 1: PCA9306DTR2GOSCT-ND; RoHS 1: RoHS Compliant; Stock 1: 2822; Pricing 1: 1=0.85, 10=0.743, 25=0.6568, 100=0.5721, 250=0.498, 500=0.42392, 1000=0.33955 (CAD); Packaging: Cut Tape (CT); Output Type: Voltage; Data Rate: -; Number of Channels: 2; Operating Temperature: -55°C ~ 125°C; Package / Case: 8-TSSOP (0.173", 4.40mm Width); Supplier Device Package: 8-TSSOP; Mounting Type: Surface Mount; ComponentLink1URL: http://www.onsemi.com/pub_link/Collateral/PCA9306-D.PDF; ComponentLink1Description: http://www.onsemi.com/pub_link/Collateral/PCA9306-D.PDF
Y1 = FX135A-327: CRYSTAL 32.768KHZ 12.5PF SMD; Manufacturer: Fox Electronics; Frequency Tolerance: ±20ppm; ESR (Equivalent Series Resistance): 70 kOhm; Operating Mode: Fundamental; OPI_VID: 101361; Supplier 1: Digi-Key; Manufacturer Part Number: FX135A-327; RoHS: RoHS Compliant; Category: Crystals and Oscillators; Stock 1: 27000; Pricing 1: 3000=1.36612, 6000=1.31733, 15000=1.26854 (CAD); Type: kHz Crystal (Tuning Fork); Frequency: 32.768kHz; Frequency Stability: -; Load Capacitance: 12.5pF; Operating Temperature: -40°C ~ 85°C; Ratings: -; Mounting Type: Surface Mount; Package / Case: 2-SMD; Size / Dimension: 0.126" L x 0.059" W (3.20mm x 1.50mm); Height: 0.035" (0.90mm); Packaging: Tape & Reel (TR); ComponentLink1URL: http://www.foxonline.com/pdfs/FX135.pdf; ComponentLink1Description: http://www.foxonline.com/pdfs/FX135.pdf; Supplier Part Number 1: 631-1002-2-ND
Y2 = NX8045GB-8.000000MHZ: CRYSTAL 8.000000 MHZ 8PF SMD; Manufacturer: NDK; Frequency Stability: ±50ppm; ESR (Equivalent Series Resistance): 200 Ohm; Operating Mode: Fundamental; OPI_VID: 101362; Supplier 1: Digi-Key; Manufacturer Part Number: NX8045GB-8.000000MHZ; RoHS: RoHS Compliant; Category: Crystals and Oscillators; Stock 1: 24000; Pricing 1: 1000=0.30318, 3000=0.29236, 5000=0.28153, 10000=0.27071, 25000=0.25988 (CAD); Type: MHz Crystal; Frequency: 8MHz; Frequency Tolerance: ±50ppm; Load Capacitance: 8pF; Operating Temperature: -10°C ~ 70°C; Ratings: -; Mounting Type: Surface Mount; Package / Case: 2-SMD; Size / Dimension: 0.315" L x 0.177" W (8.00mm x 4.50mm); Height: 0.079" (2.00mm); Packaging: Tape & Reel (TR); ComponentLink1URL: http://media.digikey.com/pdf/Data%20Sheets/NDK%20PDFs/NX8045GB.pdf; ComponentLink1Description: http://media.digikey.com/pdf/Data%20Sheets/NDK%20PDFs/NX8045GB.pdf; Supplier Part Number 1: 644-1018-2-ND